# Altium project FAT52.PrjPCB
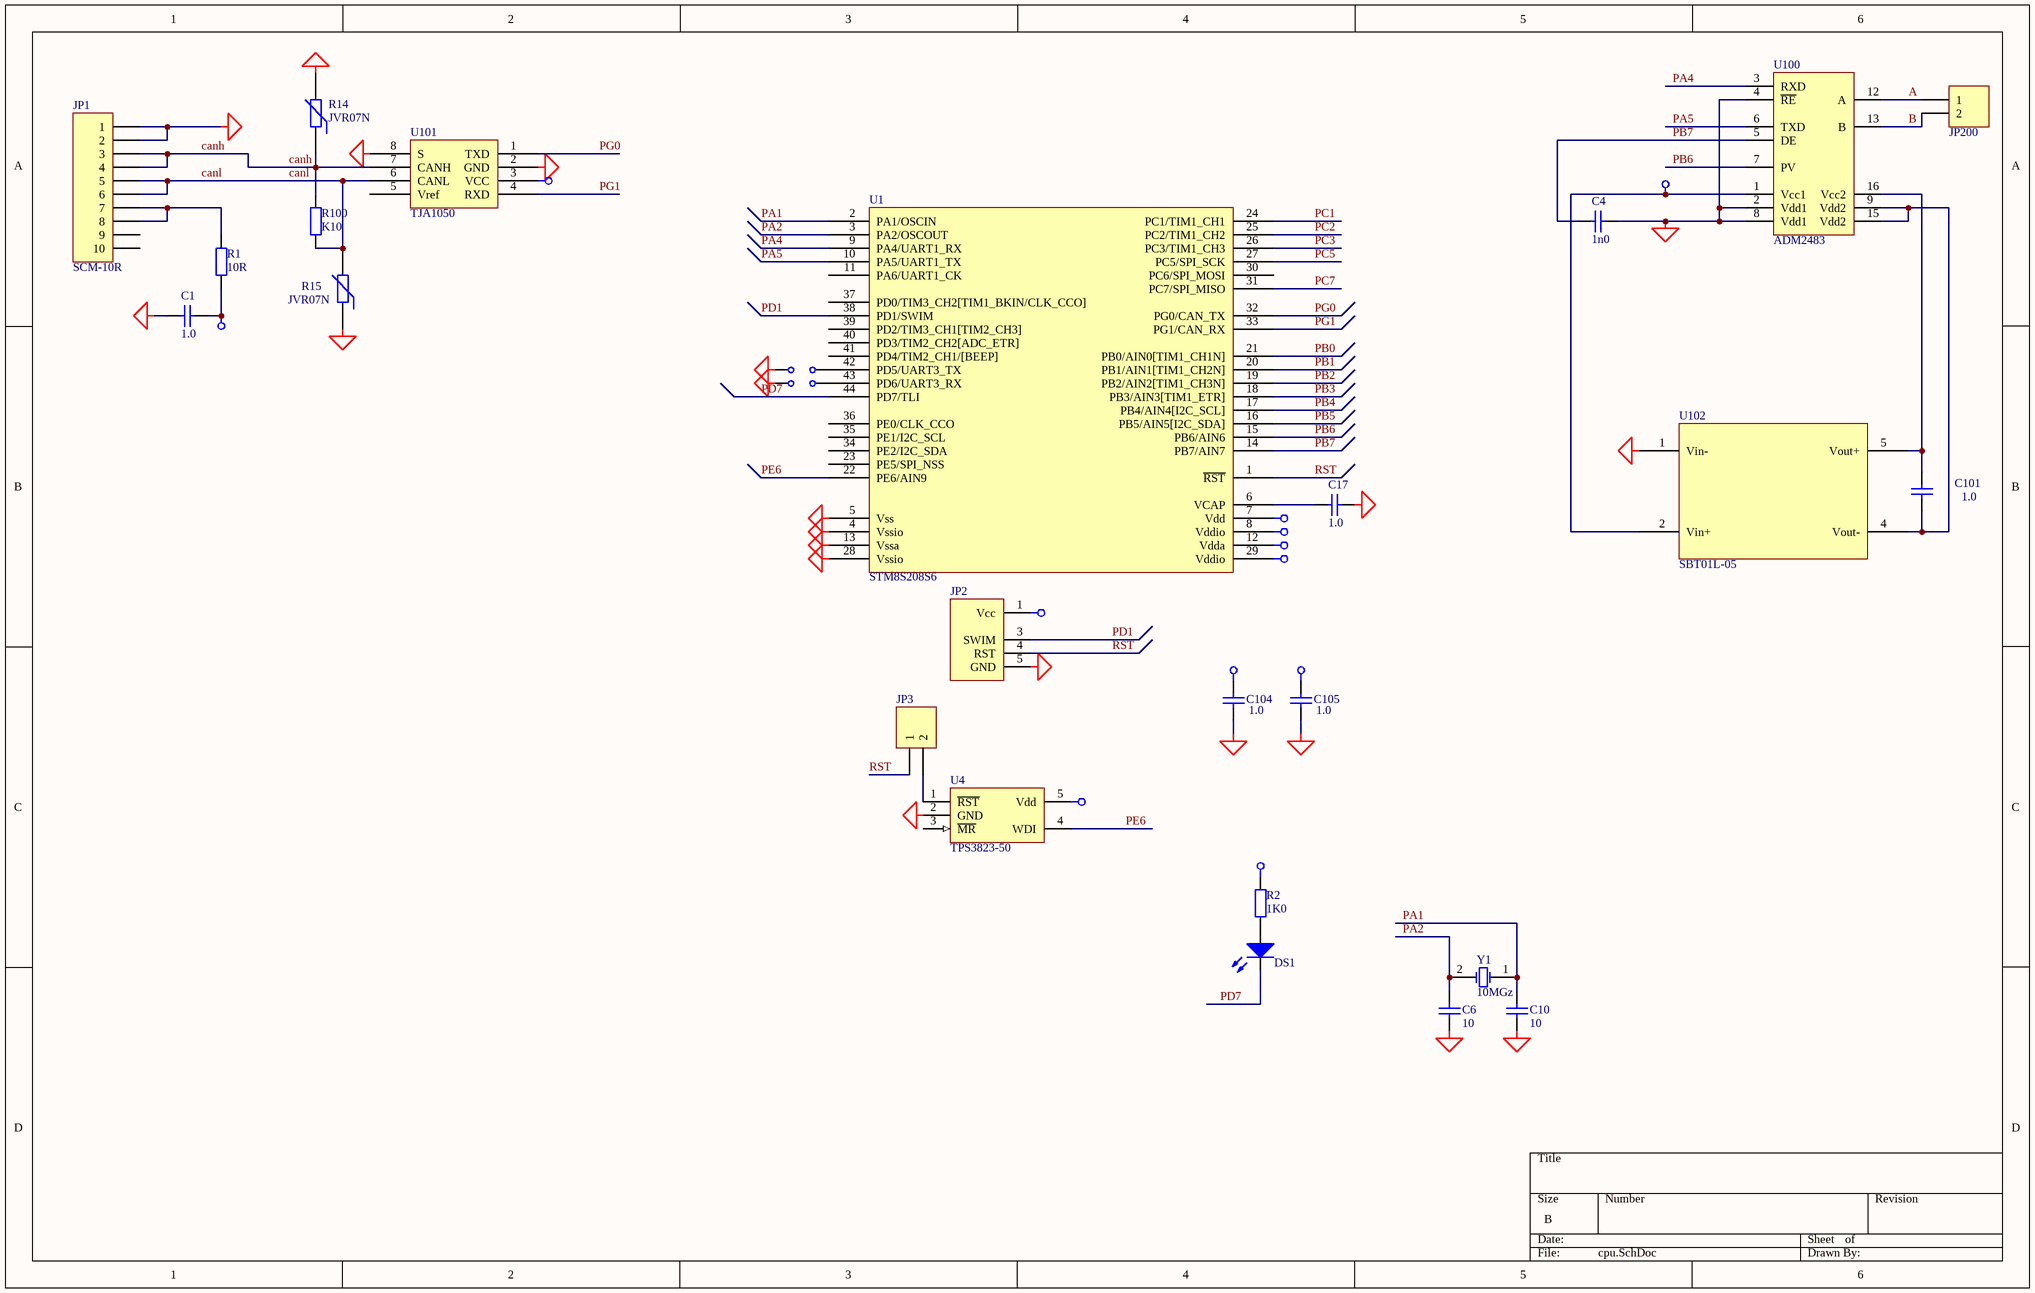
[diagram p0: cpu.SchDoc]
1 sheet, 26 parts. Net scope: global (net labels, ports and power ports of the same name join across sheets).
Board file: FAT52.PCBDOC

## Sheet cpu.SchDoc
size B

### Parts
C1  1.0  [_1206]
C4  1n0  [_1206]
C6  10  [_1206]
C10  10  [_1206]
C17  1.0  [_1206]
C101  1.0  [_1206]
C104  1.0  [_1206]
C105  1.0  [_1206]
DS1  LED0  [el3]  (value not drawn)
J1  PLS2  [jmp]  (value not drawn)
J2  PLS2  [jmp]  (value not drawn)
JP1  SCM-10R  [HDR2X5]
JP2  (no value)  [HDR1X5_uart]
JP3  (no value)  [HDR1X2]
JP200  15EDGR-3.5-2P  [2EDGR-3.5-2P]  (value not drawn)
R1  10R  [_1206]
R2  1K0  [_1206]
R14  JVR07N  [JVR07N]
R15  JVR07N  [JVR07N]
R100  K10  [_1206]
U1  STM8S208S6  [QFP10X10-G44/G10N]
U4  TPS3823-50  [SO-G5/P.95]
U100  ADM2483  [SO-G16/D10.4]
U101  TJA1050  [SO-G8/D5]
U102  SBT01L-05  [SBT01L]
Y1  10MGz  [QWARZ1]

### Nets
+5v: C1.2 C104.2 C105.2 JP2.1(Vcc) R1.1 R2.1 U1.7(Vdd) U1.8(Vddio) U1.29(Vddio) U4.5(Vdd) U100.1(Vcc1) U101.3(VCC) U102.2(Vin+)
GND: C1.1 C4.2 C6.1 C10.1 C17.1 C104.1 C105.1 J1.1 J2.1 JP1.1 JP1.2 JP2.5(GND) R14.2 R15.1 U1.4(Vssio) U1.5(Vss) U1.13(Vssa) U1.28(Vssio) U4.2(GND) U100.2(Vdd1) U100.4(~{RE}) U100.8(Vdd1) U101.2(GND) U101.8(S) U102.1(Vin-)
Uref: U1.12(Vdda)
A: JP200.1 U100.12(A)
B: JP200.2 U100.13(B)
canh: JP1.3 JP1.4 R14.1 R100.2 U101.7(CANH)
canl: JP1.5 JP1.6 R15.2 R100.1 U101.6(CANL)
PA1: C10.2 U1.2(PA1/OSCIN) Y1.1(OSC1)
PA2: C6.2 U1.3(PA2/OSCOUT) Y1.2(OSC2)
PA4: U1.9(PA4/UART1_RX) U100.3(RXD)
PA5: U1.10(PA5/UART1_TX) U100.6(TXD)
PB0: U1.21(PB0/AIN0[TIM1_CH1N])
PB1: U1.20(PB1/AIN1[TIM1_CH2N])
PB2: U1.19(PB2/AIN2[TIM1_CH3N])
PB3: U1.18(PB3/AIN3[TIM1_ETR])
PB4: U1.17(PB4/AIN4[I2C_SCL])
PB5: U1.16(PB5/AIN5[I2C_SDA])
PB6: U1.15(PB6/AIN6) U100.7(PV)
PB7: C4.1 U1.14(PB7/AIN7) U100.5(DE)
PC1: U1.24(PC1/TIM1_CH1)
PC2: U1.25(PC2/TIM1_CH2)
PC3: U1.26(PC3/TIM1_CH3)
PC5: U1.27(PC5/SPI_SCK)
PC7: U1.31(PC7/SPI_MISO)
PD1: JP2.3(SWIM) U1.38(PD1/SWIM)
PD7: DS1.2(K) U1.44(PD7/TLI)
PE6: U1.22(PE6/AIN9) U4.4(WDI)
PG0: U1.32(PG0/CAN_TX) U101.1(TXD)
PG1: U1.33(PG1/CAN_RX) U101.4(RXD)
RST: JP2.4(RST) JP3.1 U1.1(~{RST})
NetC17_2: C17.2 U1.6(VCAP)
NetC101_1: C101.1 U100.9(Vdd2) U100.15(Vdd2) U102.4(Vout-)
NetC101_2: C101.2 U100.16(Vcc2) U102.5(Vout+)
NetDS1_1: DS1.1(A) R2.2
NetJ1_2: J1.2 U1.43(PD6/UART3_RX)
NetJ2_2: J2.2 U1.42(PD5/UART3_TX)
NetJP1_7: JP1.7 JP1.8 R1.2
NetJP3_2: JP3.2 U4.1(~{RST})

Not connected (* = marked no-connect by the designer): JP1 9 10; U1 11(PA6/UART1_CK) 23(PE5/SPI_NSS) 30(PC6/SPI_MOSI) 34(PE2/I2C_SDA) 35(PE1/I2C_SCL) 36(PE0/CLK_CCO) 37(PD0/TIM3_CH2[TIM1_BKIN/CLK_CCO]) 39(PD2/TIM3_CH1[TIM2_CH3]) 40(PD3/TIM2_CH2[ADC_ETR]) 41(PD4/TIM2_CH1/[BEEP]); U4 3(~{MR}); U101 5(Vref)

### Library data of the parts
C1 C104 C105 = Cap: Capacitor; Manufacturer: Generic Components; Class I: Passive; Published: 8-Jun-2000; Revision: July-2002: Re-released for DXP Platform.; Publisher: Altium Limited; Class II: Capacitor; Value: 1.0
C4 C17 C101 = Cap Semi: Capacitor (Semiconductor SIM Model); Manufacturer: Generic Components; Class I: Passive; Value: 1,0; Published: 8-Jun-2000; Revision: July-2002: Re-released for DXP Platform.; Publisher: Altium Limited; Class II: Capacitor
C6 C10 = Cap Semi: Capacitor (Semiconductor SIM Model); Manufacturer: Generic Components; Class I: Passive; Value: 15pF; Published: 8-Jun-2000; Revision: July-2002: Re-released for DXP Platform.; Publisher: Altium Limited; Class II: Capacitor
DS1 = LED0: Typical INFRARED GaAs LED; Manufacturer: Generic Components; Class I: Optoelectronic; Published: 8-Jun-2000; Revision: July-2002: Re-released for DXP Platform.; Publisher: Altium Limited; Class II: LED
J1 J2 = JMP: Switch; Manufacturer: Generic Components; Published: 24-Mar-1999; Revision: July-2002: Re-released for DXP Platform.; Publisher: Altium Limited
JP1 = MHDR1X10: Header, 10-Pin; Manufacturer: Generic Components; Class I: Connector; Revision: July-2002: Re-released for DXP Platform.; Publisher: Altium Limited
JP2 = SWIM_CONN
JP3 = Header 2: Header, 2-Pin; Manufacturer: Generic Components; Class I: Connector; Revision: July-2002: Re-released for DXP Platform.; Publisher: Altium Limited
JP200 = MHDR1X2: Header, 2-Pin; Manufacturer: Generic Components; Class I: Connector; Revision: July-2002: Re-released for DXP Platform.; Publisher: Altium Limited
R1 R100 = Res2: Resistor; Manufacturer: Generic Components; Class I: Passive; Value: 120; Published: 8-Jun-2000; Revision: July-2002: Re-released for DXP Platform.; Publisher: Altium Limited; Class II: Resistor
R2 = Res2: Resistor; Manufacturer: Generic Components; Class I: Passive; Value: 2K7; Rule: Undefined; Published: 8-Jun-2000; Revision: July-2002: Re-released for DXP Platform.; Publisher: Altium Limited; Class II: Resistor
R14 R15 = Res Varistor: Varistor (Voltage-Sensitive Resistor); Manufacturer: Generic Components; Class I: Discrete; Published: 24-Mar-1999; Revision: July-2002: Re-released for DXP Platform.; Publisher: Altium Limited; Class II: Voltage-Sensitive Resistor
U4 = TPS3823: Reset IC; Manufacturer: National Semiconductor; Package Information: Latest Revision: Aug-1999; Class I: Power Management; Class II: Voltage Regulator; Value: TPS76333; Published: 15-Apr-2002; Datasheet: Latest Revision: Oct-1999; Package Reference: MA05B; Publisher: Altium Limited
U102 = SBT01L
Y1 = XTAL: Crystal Oscillator; Manufacturer: Generic Components; Published: 8-Jun-2000; Revision: July-2002: Re-released for DXP Platform.; Publisher: Altium Limited; Class I: Oscillator; Class II: Crystal Oscillator